# Altium schematic sheet Front.SchDoc: Front Page
size A4; ApprovedBy: LD Stanton; Author: LD Stanton; CompanyName: University of Cape Town; DrawnBy: Lawrence Stanton; Engineer: LD Stanton; Organization: University of Cape Town; Address1: Department of Electrical Engineering; Address2: Rondebosch; Address3: Cape Town; Address4: South Africa 7701; DocumentNumber: 1; SheetNumber: 1; SheetTotal: 20; Project_Name: Photovoltaic Controller
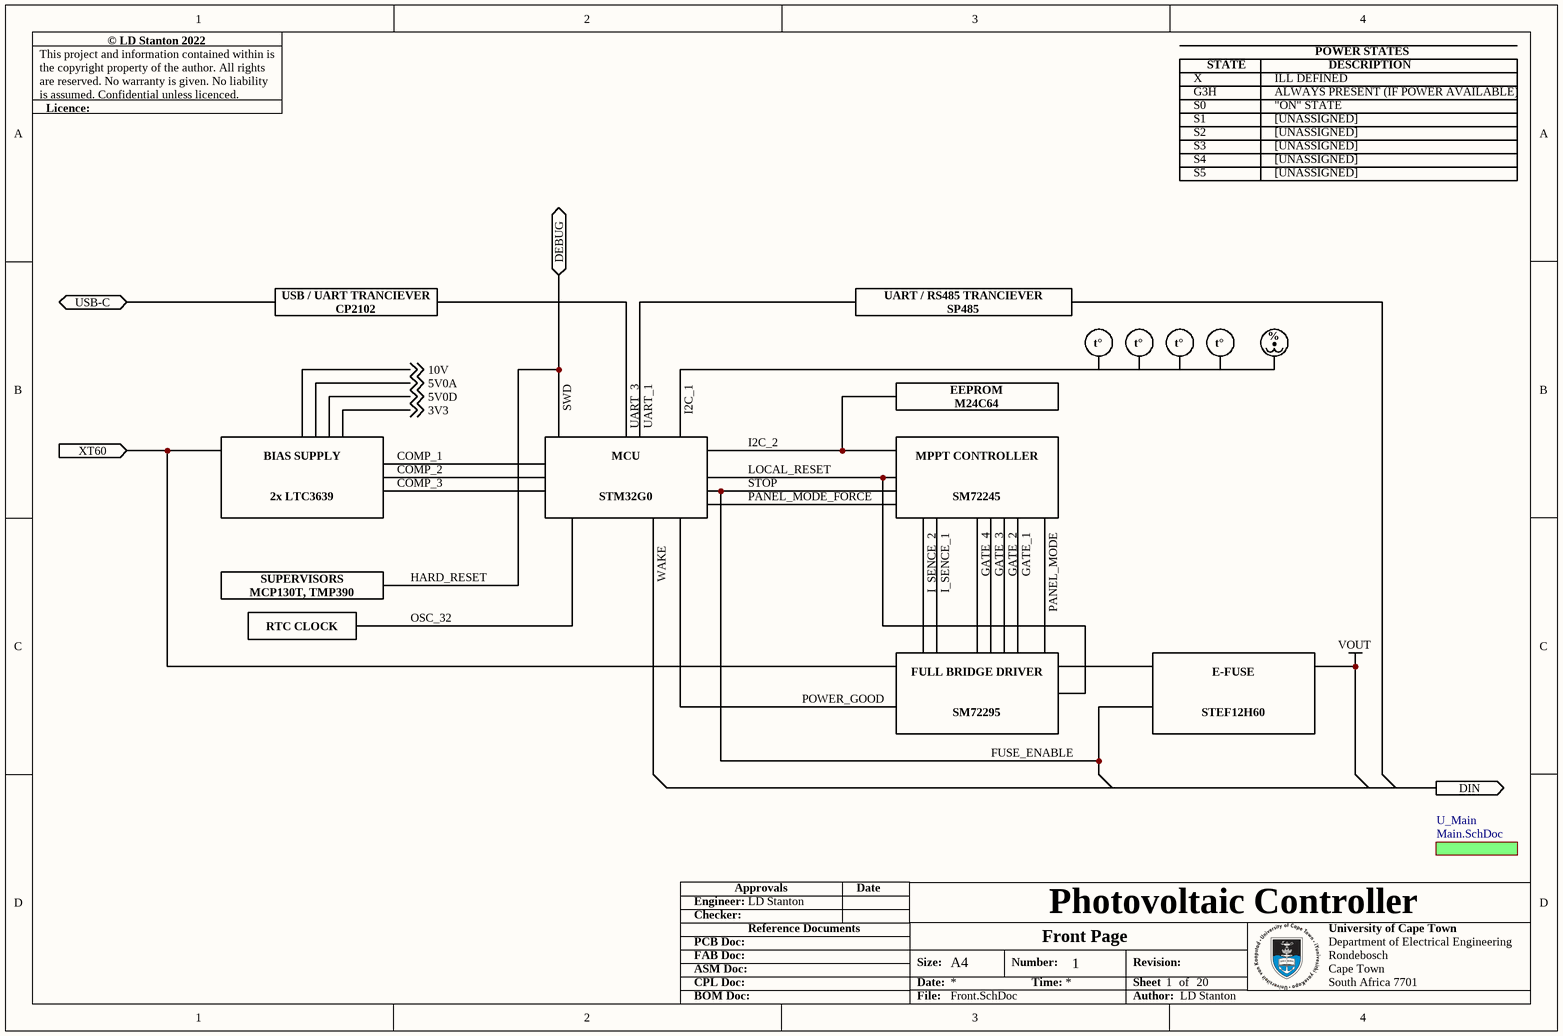
[diagram p0: Front.SchDoc]

## Parts
(Parts that share a designator on the sheet are numbered #1, #2 ... from top to bottom, then left to right.)
?#1  Text Box Small 2 Line Extra Wide Illustration  (value not drawn)  (graphical)
?#2  Text Box Small 2 Line 2X Wide Illustration  (value not drawn)  (graphical)
?#3  Text Box Small 2 Line Extra Wide Illustration  (value not drawn)  (graphical)
?#4  Text Box Large 2 Line Illustration  (value not drawn)  (graphical)
?#5  Text Box Large 2 Line Illustration  (value not drawn)  (graphical)
?#6  Text Box Large 2 Line Illustration  (value not drawn)  (graphical)
?#7  Text Box Small 2 Line Extra Wide Illustration  (value not drawn)  (graphical)
?#8  Text Box Small 1 Line Wide Illustration  (value not drawn)  (graphical)
?#9  Text Box Large 2 Line Illustration  (value not drawn)  (graphical)
?#10  Text Box Large 2 Line Illustration  (value not drawn)  (graphical)
M?#1  Thermometer Illustration  (value not drawn)  (graphical)
M?#2  Thermometer Illustration  (value not drawn)  (graphical)
M?#3  Thermometer Illustration  (value not drawn)  (graphical)
M?#4  Thermometer Illustration  (value not drawn)  (graphical)
M?#5  Humidity Illustration  (value not drawn)  (graphical)

## Sub-sheets
U_Main = Main.SchDoc: no entries

## Ports
DEBUG (bidir), DIN (out), USB-C (bidir), XT60 (in)

## Nets
VOUT: ?#10.35
3V3: ?#4.31 ; off-sheet 3V3
5V0A: ?#4.29 ; off-sheet 5V0A
5V0D: ?#4.30 ; off-sheet 5V0D
10V: ?#4.28 ; off-sheet 10V
COMP_1: ?#4.36 ?#5.58
COMP_2: ?#4.37 ?#5.56
COMP_3: ?#4.38 ?#5.54 ?#5.55
FUSE_ENABLE: ?#5.38 ?#6.54 ?#6.55 ?#10.54 ?#10.55  [also labelled STOP]
GATE_1: ?#6.43 ?#9.31
GATE_2: ?#6.44 ?#9.30
GATE_3: ?#6.45 ?#9.29
GATE_4: ?#6.46 ?#9.28
HARD_RESET: ?#5.23 ?#7.23 ; port DEBUG  [also labelled SWD]
I2C_1: ?#5.32 M?#1.1 M?#2.1 M?#3.1 M?#4.1 M?#5.1
I2C_2: ?#3.26 ?#5.35 ?#5.36 ?#6.57 ?#6.58
I_SENCE_1: ?#6.49 ?#9.25
I_SENCE_2: ?#6.50 ?#9.24
LOCAL_RESET: ?#5.37 ?#6.56 ?#9.37
OSC_32: ?#5.50 ?#8.7
PANEL_MODE: ?#6.41 ?#9.33
PANEL_MODE_FORCE: ?#5.39 ?#6.53
POWER_GOOD: ?#5.42 ?#9.54 ?#9.55
UART_1: ?#2.31 ?#5.29 ?#5.30
UART_3: ?#1.23 ?#5.25 ?#5.26 ?#5.27 ?#5.28
USB-C: ?#1.26 ; port USB-C
WAKE: ?#5.44
XT60: ?#4.57 ?#9.57 ; port XT60
Net?#1_10: ?#1.10 ?#1.11 ?#1.12 ?#1.18
Net?#4_54: ?#4.54 ?#4.55
Net?#9_35: ?#9.35 ?#9.36 ?#10.57

Not connected (* = marked no-connect by the designer): ?#1 2 3 4 5 6 8 9 14 15 16 17 19 20 21 22 24 25 27 28 29 30 31; ?#2 2 3 4 5 6 8 9 10 11 12 14 15 16 17 18 19 20 21 22 24 25 27 28 29 30 32 33 34 35 36 37 38 39 40 41; ?#3 2 3 4 5 6 8 9 10 11 12 14 15 16 17 18 19 20 21 22 23 24 25 27 28 29 30 31; ?#4 22 23 24 25 26 27 32 33 34 35 39 40 41 42 43 44 45 46 47 48 49 50 51 52 53 56 58; ?#5 22 24 31 33 34 40 41 43 45 46 47 48 49 51 52 53 57; ?#6 22 23 24 25 26 27 28 29 30 31 32 33 34 35 36 37 38 39 40 42 47 48 51 52; ?#7 2 3 4 5 6 8 9 10 11 12 14 15 16 17 18 19 20 21 22 24 25 26 27 28 29 30 31; ?#8 2 3 4 5 6 8 9 10 11 12 13 14 15 16 17 18 19 20 21; ?#9 22 23 26 27 32 34 38 39 40 41 42 43 44 45 46 47 48 49 50 51 52 53 56; ?#10 22 23 24 25 26 27 28 29 30 31 32 33 34 36 37 38 39 40 41 42 43 44 45 46 47 48 49 50 51 52 53 56

## Notes on the sheet
- G3H
- S0
- X
- STATE
- ALWAYS PRESENT (IF POWER AVAILABLE)
- "ON" STATE
- ILL DEFINED
- POWER STATES
- DESCRIPTION
- S1
- S2
- S3
- S4
- S5
- [UNASSIGNED]
- © LD Stanton 2022
- This project and information contained within is the copyright property of the author. All rights are reserved. No warranty is given. No liability is assumed. Confidential unless licenced.
- Licence:
- Engineer:
- Checker:
- Approvals
- Date
- PCB Doc:
- ASM Doc:
- FAB Doc:
- CPL Doc:
- Reference Documents
- Size:
- Date:
- A4
- Number:
- Time:
- Revision:
- Sheet
- of
- BOM Doc:
- File:
- Author:
- (in symbol CMP-00041-1) t°
- (in symbol CMP-00087-1) %

## Library data of the parts
?#1 = CMP-00085-2: Generic Text Box Extra Wide 2 Line Wide for Illustration; Line2: CP2102; Line1: USB / UART TRANCIEVER
?#2 = CMP-00086-1: Generic Text Box 2X Wide 2 Line Wide for Illustration; Line1: UART / RS485 TRANCIEVER; Line2: SP485
?#3 = CMP-00085-2: Generic Text Box Extra Wide 2 Line Wide for Illustration; Line2: M24C64; Line1: EEPROM
?#4 = CMP-00080-3: Generic Text Box Large 2 Line for Illustration; Line2: 2x LTC3639; Line1: BIAS SUPPLY
?#5 = CMP-00080-3: Generic Text Box Large 2 Line for Illustration; Line2: STM32G0; Line1: MCU
?#6 = CMP-00080-3: Generic Text Box Large 2 Line for Illustration; Line2: SM72245; Line1: MPPT CONTROLLER
?#7 = CMP-00085-2: Generic Text Box Extra Wide 2 Line Wide for Illustration; Line2: MCP130T, TMP390; Line1: SUPERVISORS
?#8 = CMP-00088-1: Generic Text Box Small 1 Line Wide for Illustration; Line1: RTC CLOCK
?#9 = CMP-00080-2: Generic Text Box Large 2 Line for Illustration; Line2: SM72295; Line1: FULL BRIDGE DRIVER
?#10 = CMP-00080-2: Generic Text Box Large 2 Line for Illustration; Line2: STEF12H60; Line1: E-FUSE
M?#1-M?#4 = CMP-00041-1: Thermometer for Illustration; Placement: CRITICAL
M?#5 = CMP-00087-1: Humidity Sensor for Illustration; Placement: CRITICAL